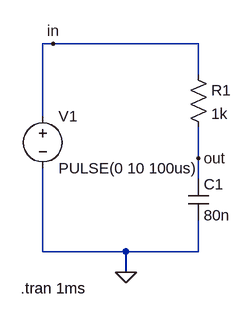
[diagram p0: schematic rc-tiefpass.asc]
rc-tiefpass.asc, the LTspice schematic file:
Version 4
SHEET 1 880 680
WIRE 80 -32 64 -32
WIRE 304 -32 80 -32
WIRE 304 16 304 -32
WIRE 64 80 64 -32
WIRE 304 144 304 96
WIRE 304 176 304 144
WIRE 64 288 64 160
WIRE 192 288 64 288
WIRE 304 288 304 240
WIRE 304 288 192 288
WIRE 192 320 192 288
FLAG 192 320 0
FLAG 80 -32 in
FLAG 304 144 out
SYMBOL voltage 64 64 R0
WINDOW 123 0 0 Left 2
WINDOW 39 0 0 Left 2
SYMATTR InstName V1
SYMATTR Value PULSE(0 10 100us)
SYMBOL res 288 0 R0
SYMATTR InstName R1
SYMATTR Value 1k
SYMBOL cap 288 176 R0
SYMATTR InstName C1
SYMATTR Value 80n
TEXT 30 344 Left 2 !.tran 1ms

The netlist it stands for:
* rc-tiefpass.asc
V1 in 0 PULSE(0 10 100us)
R1 in out 1k
C1 out 0 80n
.tran 1ms
.backanno
.end